# Altium schematic sheet MagnetV1_2.SchDoc
size A4; SheetNumber: 1; SheetTotal: 1
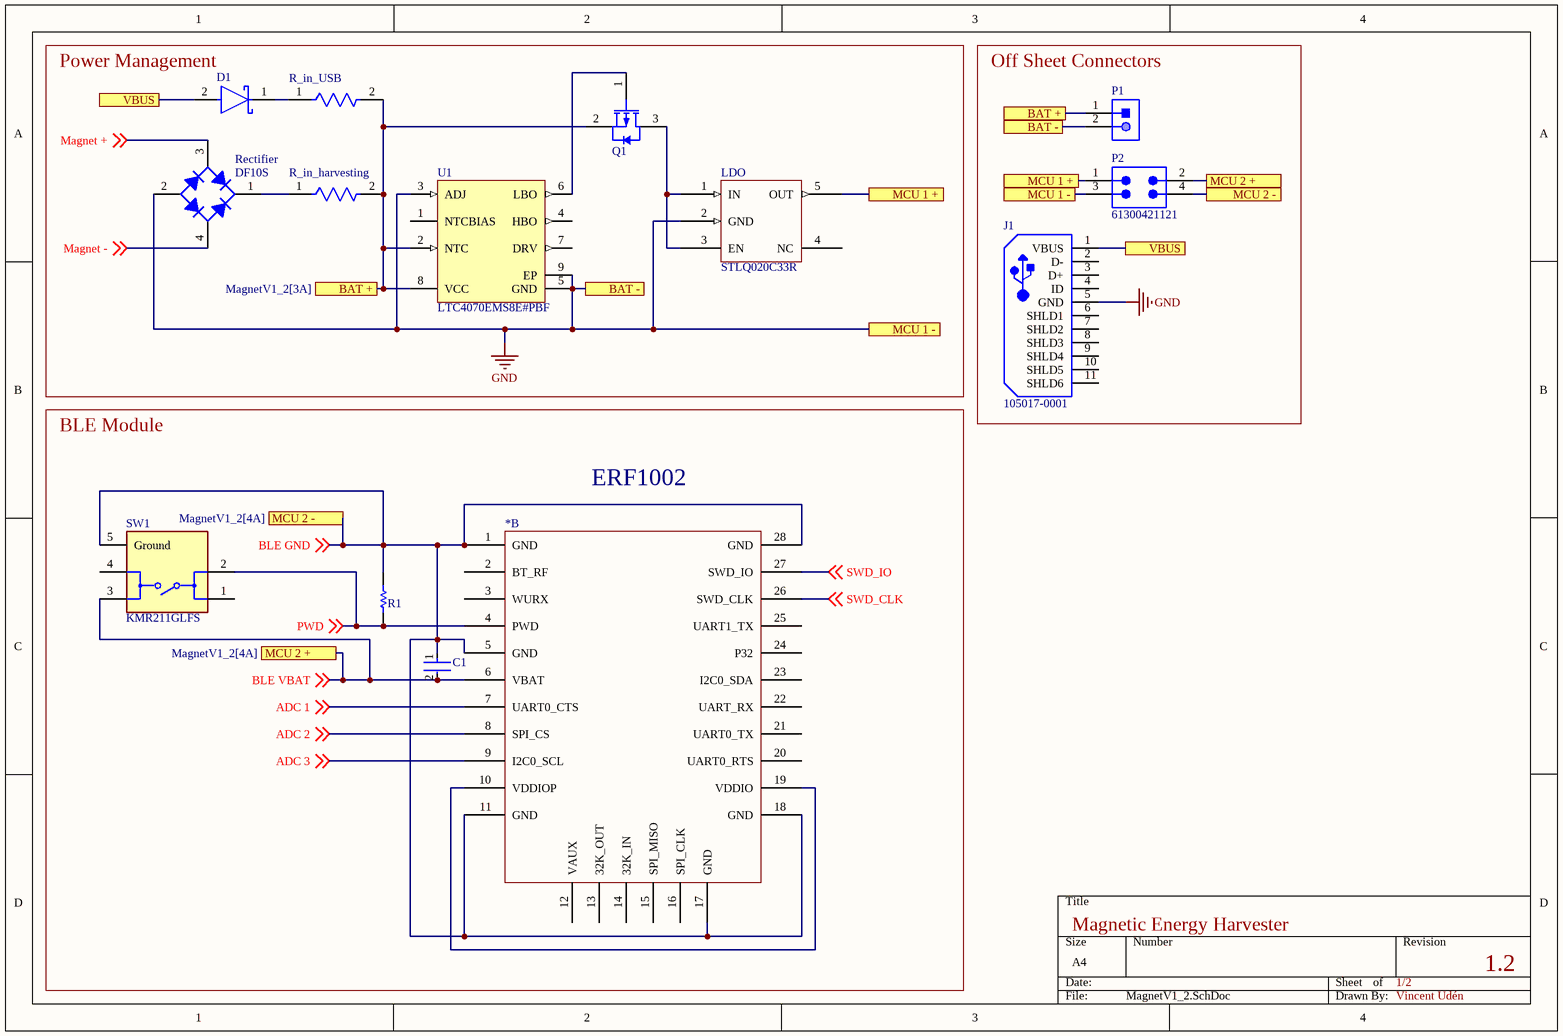
[diagram p0: MagnetV1_2.SchDoc]

## Parts
*  ERF1002  [ERF1002]  (part B of 2)
C1  TMK107B7105KA-T  [FP-0603-L_1_6_0_1-W_0_8_0-IPC_A]  (value not drawn)
D1  STPS1H100A  [FP-SMA-MFG]  (value not drawn)
J1  105017-0001  [USB-MICRO-B_V]
LDO  STLQ020C33R  [STLQ020CXXR]
P1  S2B-PH-K-S(LF)(SN)  [JST-S2B-PH-K-S_V]  (value not drawn)
P2  61300421121  [61300421121]
Q1  NTR4171PT1G  [ONSC-SOT-23-3-318-08_V]  (value not drawn)
R1  CRCW060310K0FKEA  [RESC1609X50X30NL8T20]  (value not drawn)
R_in_harvesting  CRCW060310R0FKEA  [FP-CRCW0603-e3-IPC_A]  (value not drawn)
R_in_USB  CRCW060310R0FKEA  [FP-CRCW0603-e3-IPC_A]  (value not drawn)
Rectifier  DF10S  [FAIR-SDIP-4_V]
SW1  KMR211GLFS  [FP-KMR211GLFS-MFG]
U1  LTC4070EMS8E#PBF  [LT-MS8E-8-2060X1830TP_M]

## Blocks framed on the sheet
Power Management: D1 LDO Q1 R_in_harvesting R_in_USB Rectifier U1
Off Sheet Connectors: J1 P1 P2
BLE Module: * C1 R1 SW1

## Ports
BAT + (see MagnetV1_2[1B]), BAT + (see MagnetV1_2[3A]), BAT - (see MagnetV1_2[2B]), BAT - (see MagnetV1_2[3A]), MCU 1 + (see MagnetV1_2[3A]), MCU 1 - (see MagnetV1_2[3A]), MCU 1 - (see MagnetV1_2[3B]), MCU 2 + (see MagnetV1_2[1C]), MCU 2 + (see MagnetV1_2[4A]), MCU 2 - (see MagnetV1_2[1C]), MCU 2 - (see MagnetV1_2[4A]), VBUS (see MagnetV1_2[1A]), VBUS (see MagnetV1_2[3A])

## Nets
GND: J1.5(GND) LDO.2(GND) P1.2 P2.3 Rectifier.2(A) U1.3(ADJ) U1.5(GND) U1.9(EP) ; port MCU 1 -, port BAT -
ADC 1: *.7(UART0_CTS) ; off-sheet ADC 1
ADC 2: *.8(SPI_CS) ; off-sheet ADC 2
ADC 3: *.9(I2C0_SCL) ; off-sheet ADC 3
BAT +: P1.1 Q1.2(S) R_in_harvesting.2 R_in_USB.2 U1.2(NTC) U1.8(VCC) ; port BAT +
BLE GND: *.1(GND) *.5(GND) *.11(GND) *.17(GND) *.18(GND) *.28(GND) C1.1 P2.4 R1.2 SW1.5(Ground) ; off-sheet BLE GND, port MCU 2 -
BLE VBAT: *.6(VBAT) C1.2 P2.2 SW1.3 ; off-sheet BLE VBAT, port MCU 2 +
Magnet +: Rectifier.3(C) ; off-sheet Magnet +
Magnet -: Rectifier.4(C) ; off-sheet Magnet -
MCU 1 +: LDO.5(OUT) P2.1 ; port MCU 1 +
PWD: *.4(PWD) R1.1 SW1.2 ; off-sheet PWD
SWD_CLK: *.26(SWD_CLK) ; off-sheet SWD_CLK
SWD_IO: *.27(SWD_IO) ; off-sheet SWD_IO
VBUS: D1.2(A) J1.1(VBUS) ; port VBUS
Net*_10: *.10(VDDIOP) *.19(VDDIO)
NetD1_1: D1.1(K) R_in_USB.1
NetLDO_1: LDO.1(IN) LDO.3(EN) Q1.3(D)
NetQ1_1: Q1.1(G) U1.6(LBO)
NetR_in_harvesting_1: R_in_harvesting.1 Rectifier.1(K)

Not connected (* = marked no-connect by the designer): * 2(BT_RF) 3(WURX) 12(VAUX) 13(32K_OUT) 14(32K_IN) 15(SPI_MISO) 16(SPI_CLK) 20(UART0_RTS) 21(UART0_TX) 22(UART_RX) 23(I2C0_SDA) 24(P32) 25(UART1_TX); J1 2(D-) 3(D+) 4(ID) 6(SHLD1) 7(SHLD2) 8(SHLD3) 9(SHLD4) 10(SHLD5) 11(SHLD6); LDO 4(NC); SW1 1 4; U1 1(NTCBIAS) 4(HBO) 7(DRV)

## Notes on the sheet
- Magnetic Energy Harvester
- 1/2
- 1.2
- Vincent Udén

## Library data of the parts
* = ERF1002: BLE Module
C1 = CMP-2000-07259-3: None; Voltage Rating (DC): 25V; Dielectric: X7R; Capacitance: 1uF; Tolerance: 10%; Height: 0.8mm; Case Code (Metric): 1608; Max Operating Temperature: 125°C; Case Code (Imperial): 0603; Case/Package: 0603; Resistor Type: Ceramic; Halogen Free: Halogen Free; Series: M; Voltage Rating: 25V; Number of Pins: 2; Depth: 0.8mm; RoHS Compliant: Yes; Mount: Surface Mount; Min Operating Temperature: -55°C; Length: 1.6mm; Contact Plating: Tin; Radiation Hardening: No; Width: 0.031inch; Construction: Flat; Thickness: 0.035inch; Packaging: Tape and Reel; Termination: SMD/SMT; REACH SVHC: No SVHC; Package Quantity: 1
D1 = CMP-2000-07173-2: DIODE SCHOTTKY 100V 1A SMA; Manufacturer: STMicroelectronics; Standoff Height: 0.05mm; Peak Reverse Current: 4uA; Max Junction Temp: +175°C; Max Surge Forward Current: 50A; Temperature Range High: +175°C; Device Class L3: Schottky Diodes; Height: 2.65mm; Manufacturer Part Number: STPS1H100A; ComponentLink2URL: https://www.st.com/resource/en/datasheet/stps1h100.pdf; Category: Diode; RoHS: TRUE; Automotive: No; Digikey Description: DIODE SCHOTTKY 100V 1A SMA; Mouser Description: Schottky Diodes & Rectifiers 1.0 Amp 100 Volt; Device Class L2: Diodes; ComponentLink2Description: Datasheet; Forward Current: 1A; Package: SMA; Octopart: https://octopart.com/stps1h100a-stmicroelectronics-55399361; Temperature: to +175°C; Max Repetitive Reverse Voltage: 100V; Lead Free: Yes; Device Class L1: Discrete Semiconductors
J1 = CMP-2000-05827-1: Micro-USB B Receptacle, Right Angle, Bottom Mount, Surface Mount, with Solder Tabs, -30 to 85 degC, 5-Pin USB, RoHS, Tape and Reel; Manufacturer: Molex; Featured Product: Micro-USBConnectorsUSBConnectors; Other Names: WM1399DKR; Package Version: Rev. F, 12/2012; Number of Contacts: 5; Connector Type: USB-microB; Catalog Drawings: 1050170001; 3D Model: 105017-0001.stp; Mating Products: WM17145-ND-CABLEMICROUSBBTOSTDA1.0MWM17147-ND-CABLEMICROUSBBTOSTDA2.0MWM17146-ND-CABLEMICROUSBBTOSTDA1.5M; PCN Assembly/Origin: ResinSupplier21/Oct/2015; Voltage - Max: 30V; Online Catalog: Molex-MicroUSB; Manufacturer URL: http://www.molex.com/; Package Description: 5-Leads USB, Micro B, Body 7.5 x 5 mm, Pitch 0.65 mm; Datasheet URL: http://www.molex.com/elqNow/elqRedir.htm?ref=http://www.molex.com/webdocs/datasheets/pdf/en-us/1050170001_IO_CONNECTORS.pdf; Ingress Protection: -; Datasheet Version: 03/2016; Mounting Type: BoardCutout,SurfaceMount,RightAngle; Circuits: 5; Standard Package: 1; Package Reference: MICRO-B; Package URL: http://www.molex.com/pdm_docs/sd/1050170001_sd.pdf; Category: Connectors,Interconnects; Series: -; RoHS Information: 1050170001CertofCompliance; Features: Shielded,SolderRetention; Family: USB,DVI,HDMIConnectors; Specifications: -; Gender: Receptacle; Packaging: Digi-Reel®; Mounting Technology: SurfaceMount
LDO = STLQ020C33R: Low-Dropout Linear Regulator 3.3 V output
P1 = CMP-1755-00004-1: Male Header, Pitch 2 mm, 1 x 2 Position, Height 4.8 mm, Tail Length 3.4 mm, -25 to 85 degC, RoHS, Bulk; Case\Package: Radial; Tolerance: 20%; Capacitance: 10 uF; Voltage Rating (DC): 50 V; Packaging: Bulk; ComponentLink1URL: http://www.jst-mfg.com/product/pdf/eng/ePH.pdf; Radiation Hardening: No; Height: 11 mm; Package Quantity: 200; PackageDescription: Male Header, Pitch 2 mm, 1 x 2 Position, Height 4.8 mm, Tail Length 3.4 mm; PackageReference: S2B-PH-K-S; Diameter: 5 mm; Pins: 2; Mount: Through Hole; Max Operating Temperature: 85 degC; Min Operating Temperature: -40 degC; ComponentLink1Description: Datasheet; DatasheetVersion: Dec-12; Length: 11 mm; Lead Pitch: 2 mm; REACH SVHC: No SVHC; Voltage Rating: 50 V; RoHSCompliant: true
P2 = CMP-1502-01066-4: NexarPartId: 32855524; Number of Positions: 4; Operating Supply Voltage: 250V; Pitch: 2.54mm; Connector Type: Male Pin; Current Rating: 3A; Contact Resistance: 20mΩ; Gender: Male; Number of Pins: 4; Max Operating Temperature: 105°C; Number of Contacts: 4; Contact Mating Length: 5.9944mm; Min Operating Temperature: -40°C; Orientation: Vertical; Height: 8.89mm; Mount: Through Hole; Lead Pitch: 2.54mm; Contact Material: Copper; Color: Black; Voltage Rating: 250V; RoHS: Compliant; Termination: Solder; Row Spacing: 2.54mm; Contact Plating: Gold; Number of Rows: 2; Lead Free: Lead Free; REACH SVHC: Unknown; Packaging: Bulk
Q1 = CMP-1058-00738-1: Power MOSFET, -30 V, 3.5 A, Single P-Channel, 3-Pin SOT-23, Pb-Free, Tape and Reel; Manufacturer: On Semiconductor; VGS Max (V): 12; V(BR)DSS Min (V): 30; Crss Typ (pF): 65; VGS(th) Max (V): 1.4; Ciss Typ (pF): 720; Qrr Typ (nC): 8; Coss Typ (pF): 95; Channel Polarity: P Channel; ComponentLink2URL: http://www.onsemi.cn/pub_link/Collateral/NTR4171P-D.PDF; ComponentLink1Description: Manufacturer URL; PartNumber: NTR4171PT1G; Mounting Technology: Surface Mount; ComponentLink1URL: http://www.onsemi.com/; Packing: Tape and Reel; Package Type: SOT-23-3; ComponentLink2Description: Datasheet; PackageReference: SOT-23-3-318-08; Configuration: Single; ComponentLink3Description: Package Specification; DatasheetVersion: Rev. 1; PackageVersion: Rev. AP, 11/2009; RoHS: Pb-Free; PackageDescription: 3-Pin Small Outline Transistor, Body 2.92 x 1.3 mm, Pitch 0.95 mm; ComponentLink3URL: http://www.onsemi.cn/pub_link/Collateral/318-08.PDF
R1 = CMP-1666-00005-4: Chip Resistor, 10 KOhm, +/- 1%, 100 mW, -55 to 155 degC, 0603 (1608 Metric), RoHS, Tape and Reel; Manufacturer: Vishay Semiconductor; Voltage Rating: 75 V; Max Operating Temperature: 155 degC; PackageDescription: 2-Pin Surface Mount Device, Body 1.575 x 0.85 mm; ComponentLink1Description: Manufacturer URL; RoHSCompliant: true; PackageReference: 0603; REACH SVHC: Unknown; Length: 1.55 mm; DatasheetVersion: 06/2012; Packaging: Tape and Reel; Min Operating Temperature: -55 degC; Mounting Technology: Surface Mount; ComponentLink2URL: https://datasheet.ciiva.com/11809/0900766b80d98afc-11809037.pdf; Height: 0.45 mm; ComponentLink2Description: Datasheet; Package Quantity: 5000; ComponentLink1URL: http://www.vishay.com/
R_in_harvesting R_in_USB = CMP-2000-03845-2: RES Thick Film, 10Ω, 1%, 0.1W, 100ppm/°C, 0603; Resistance: 10R; Voltage Rating (DC): 75V; Power Rating: 100mW; Depth: 0.85mm; Height: 0.45mm; Package Quantity: 10; Temperature Coefficient: 100ppm/°C; Weight: 7.1E-05oz; Case Code (Metric): 1608; Number of Terminations: 2; Features: Automotive AEC-Q200; Termination: SMD/SMT; Lead Free: Lead Free; Mount: Surface Mount; Number of Pins: 2; Tolerance: 1%; Max Power Dissipation: 100mW; Width: 0.033inch; Contact Plating: Tin; Case Code (Imperial): 0603; Max Operating Temperature: 155°C; Min Operating Temperature: -55°C; Voltage Rating: 75V; Length: 1.55mm; Case/Package: 0603; Composition: Thick Film; Packaging: Tape and Reel; Military Standard: Not
Rectifier = CMP-2000-06153-1: Bridge Rectifier, 1.5 A, 1000 V, 4-Pin SDIP, RoHS, Tape and Reel; Manufacturer: FairchildSemiconductor; Configuration: Single; Peak Average Forward Current: 1.5@Ta=40CA; Peak Reverse Repetitive Voltage: 1000V; Peak Reverse Current: 5uA; Bridge Type: SinglePhase; Peak Forward Voltage: 1.1@1AV; Datasheet Version: Rev. 1.5, 05/2015; Package: 4SDIPSMD; Operating Temperature: -55to150°C; Package Reference: SDIP 4L; Datasheet URL: http://www.farnell.com/datasheets/1941063.pdf; Packaging: Tape&Reel; Manufacturer URL: https://www.fairchildsemi.com/; Mounting Technology: SurfaceMount; Category: BridgeRectifier; Package Description: 4-Pin Surface Mount Device, Body 8.28 x 6.35 mm, Pitch 5.1 mm; Mounting: SurfaceMount
SW1 = CMP-10040-000023-1: SWITCH TACTILE SPST-NO 0.05A 32V; Switch Function: Off-Mom; Throw Configuration: SPST; Switch Travel: 0.2mm; Current Rating: 50mA; Illumination Type: Non-Illuminated; Actuator Length: 0.5mm; Power Rating: 1W; Operating Force: 1.2N; Actuator Type: Standard; Mechanical Life: 200000Cycles; REACH SVHC: No SVHC; Voltage Rating (DC): 32V; Length: 2.8mm; Min Operating Temperature: -40°C; Mount: Surface Mount; Max Voltage Rating (DC): 32V; Width: 2.8mm; Depth: 4.6mm; Packaging: Tape and Reel; Lead Free: Lead Free; Contact Material: Silver; Termination: Gull Wing; Package Quantity: 1; Contact Current Rating: 50mA; Orientation: Straight; Max Operating Temperature: 85°C; Radiation Hardening: No; Max Current Rating: 50mA; Contact Plating: Silver
U1 = CMP-0473-00111-1: Li-Ion / Polymer Shunt Battery Charger System, 8-pin SOP (MS8E-8), -40 to 125 degC, Pb-Free; Manufacturer: Linear Technology; Number of Outputs: 1; Topology: Shunt Battery Charger; ComponentLink3URL: http://cds.linear.com/docs/en/datasheet/4070fc.pdf; PackageReference: MS8E-8; ComponentLink1Description: Manufacturer URL; ComponentLink2URL: http://cds.linear.com/docs/en/datasheet/4070fc.pdf; PackageVersion: Rev. E; ComponentLink3Description: Package Specification; ComponentLink1URL: http://www.linear.com/; PackageDescription: 8-Pin Plastic MSOP, Exposed Die Pad, Body 3 x 3 mm, Pitch 0.65 mm; RoHS: TRUE; Mounting Technology: Surface Mount; DatasheetVersion: Rev. E; PartNumber: LTC4070EMS8E#PBF; ComponentLink2Description: Datasheet